# Altium project Vexter.PrjPcb
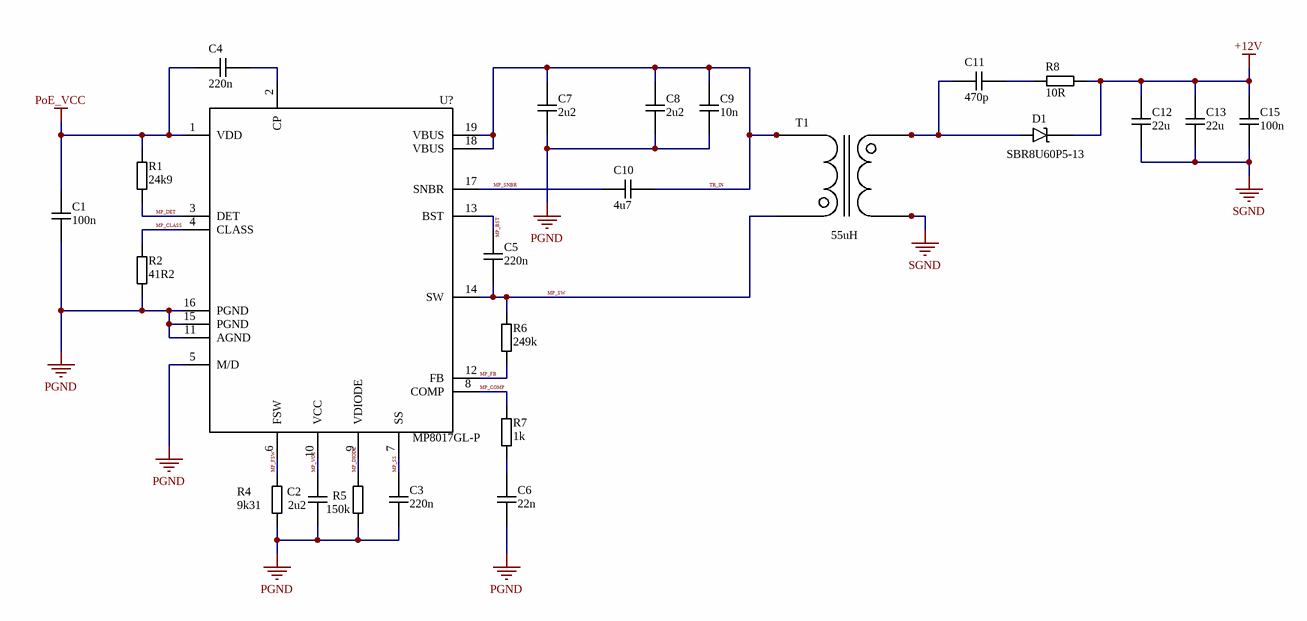
[diagram p0: First page.SchDoc]
1 sheet, 24 parts. Net scope: global (net labels, ports and power ports of the same name join across sheets).
Board file: Vexter_PCB.PcbDoc

## Sheet First page.SchDoc
size A3; SheetNumber: 1; SheetTotal: 1; PageSetup: Record=PageOptions|CenterHorizontal=True|CenterVertical=True|PrintScale=1.00|XCorrection=1.00|YCorrection=1.00|PrintKind=0|BorderSize=5000000|LeftOffset=0|BottomOffset=0|Orientation=2|PaperLength=1000|PaperWidth=1000|Scale=100|PaperSource=7|PrintQuality=-4|MediaType=1|DitherType=10|PaperKind=A3 297 x 420 mm|PrintScaleMode=1

### Parts
C1  100n  [CAP_0603]
C2  2u2  [CAP_0402]
C3  220n  [CAP_0402]
C4  220n  [CAP_0402]
C5  220n  [CAP_0402]
C6  22n  [CAP_0402]
C7  2u2  [CAP_1210]
C8  2u2  [CAP_1210]
C9  10n  [CAP_0603]
C10  4u7  [CAP_0805]
C11  470p  [CAP_0603]
C12  22u  [CAP_0805]
C13  22u  [CAP_0805]
C15  100n  [CAP_0603]
D1  SBR8U60P5-13  [PowerDI5-3]
R1  24k9  [RES_0402]
R2  41R2  [RES_0402]
R4  9k31  [RES_0402]
R5  150k  [RES_0402]
R6  249k  [RES_0402]
R7  1k  [RES_0402]
R8  10R  [RES_1206]
T1  55uH  [TWPEP090909B300T]
U?  MP8017GL-P  [QFN-19 (3mmx4mm)]

### Nets
+12V: C12.2 C13.2 C15.2 D1.K R8.2
PGND: C1.1 C2.1 C3.1 C6.1 C7.1 C8.1 C9.1 R2.1 R4.1 R5.1 U?.5(M/D) U?.11(AGND) U?.15(PGND) U?.16(PGND)
PoE_VCC: C1.2 C4.2 R1.2 U?.1(VDD)
SGND: C12.1 C13.1 C15.1 T1.5 T1.6
MP_BST: C5.2 U?.13(BST)
MP_CLASS: R2.2 U?.4(CLASS)
MP_COMP: R7.2 U?.8(COMP)
MP_DET: R1.1 U?.3(DET)
MP_DIODE: R5.2 U?.9(VDIODE)
MP_FB: R6.1 U?.12(FB)
MP_FSW: R4.2 U?.6(FSW)
MP_SNBR: C10.1 U?.17(SNBR)
MP_SS: C3.2 U?.7(SS)
MP_SW: C5.1 R6.2 T1.3 U?.14(SW)
MP_VCC: C2.2 U?.10(VCC)
TR_IN: C7.2 C8.2 C9.2 C10.2 T1.1 T1.2 U?.18(VBUS) U?.19(VBUS)
NetC4_1: C4.1 U?.2(CP)
NetC6_2: C6.2 R7.1
NetC11_1: C11.1 D1.A T1.7 T1.8
NetC11_2: C11.2 R8.1

### Notes on the sheet
- Board name
- TITLE
- DATE
- REVISION
- DRAWN BY
- PAGE

### Library data of the parts
C1 = CAP_100n_0603_100V_10%_X7R: Capacitor SMD 100n 0603 50V 10% X7R; Manufacturer: Samsung Electro-Mechanics; Part Number: CL10B104KC8NNNC; Generic?: Yes; Obsolete?: No; Distributor Link: https://cz.mouser.com/ProductDetail/Samsung-Electro-Mechanics/CL10B104KC8NNNC?qs=sGAEpiMZZMvsSlwiRhF8qrStdQmkkjBl%2FQhwBGJ%2FxFbl1yCQ6UBl3A%3D%3D; Parameters: 100n_0603_100V_10%_X7R; Box: *; Datasheet: *; Alternative Part Number: *
C2 = CAP_2u2_0402_35V_10%_X5R: Capacitor SMD 2u2 0402 35V 10% X5R; Manufacturer: Murata; Part Number: GRM155R6YA225KE11D; Generic?: Yes; Obsolete?: No; Distributor Link: https://cz.mouser.com/ProductDetail/Murata-Electronics/GRM155R6YA225KE11D?qs=sGAEpiMZZMvsSlwiRhF8qtbaqYG%252B%252Bbbwp%252BrKmbG5LFQ9nM4QIaoJFg%3D%3D; Parameters: 2u2_0402_35V_10%_X5R; Box: *; Datasheet: *; Alternative Part Number: *
C3-C5 = CAP_220n_0402_25V_10%_X5R: Capacitor SMD 220n 0402 25V 10% X5R; Manufacturer: Murata; Part Number: GRT155R61E224KE01D; Generic?: Yes; Obsolete?: No; Distributor Link: https://cz.mouser.com/ProductDetail/Murata-Electronics/GRT155R61E224KE01D?qs=drgMNd%252BkGPMmDaNrMlXt5Q%3D%3D; Parameters: 220n_0402_25V_10%_X5R; Box: *; Datasheet: *; Alternative Part Number: *
C6 = CAP_22n_0402_25V_10%_X7R: Capacitor SMD 22n 0402 25V 10% X7R; Manufacturer: TDK; Part Number: C1005X7R1E223K050BB; Generic?: Yes; Obsolete?: No; Distributor Link: https://cz.mouser.com/ProductDetail/TDK/C1005X7R1E223K050BB?qs=sGAEpiMZZMvsSlwiRhF8qsDt8B2LujiHv9ZMBJ9wABM%3D; Parameters: 22n_0402_25V_10%_X7R; Box: *; Datasheet: *; Alternative Part Number: *
C7 C8 = CAP_2u2_1210_100V_10%_X7R: Capacitor SMD 2u2 1210 100V 10% X7R; Manufacturer: Samsung Electro-Mechanics; Part Number: CL32B225KCJSNNE; Generic?: Yes; Obsolete?: No; Distributor Link: https://cz.mouser.com/ProductDetail/Samsung-Electro-Mechanics/CL32B225KCJSNNE?qs=X6jEic%2FHinBTqQESZCUGKg%3D%3D; Parameters: 2u2_1210_100V_10%_X7R; Box: *; Datasheet: *; Alternative Part Number: *
C9 = CAP_10n_0603_100V_10%_X7R: Capacitor SMD 10n 0603 100V 10% X7R; Manufacturer: Murata; Part Number: GRM188R72A103KA01D; Generic?: Yes; Obsolete?: No; Distributor Link: https://cz.mouser.com/ProductDetail/Murata-Electronics/GRM188R72A103KA01D?qs=krk%2F6UQjCzAtl9phuocbug%3D%3D; Parameters: 10n_0603_100V_10%_X7R; Box: *; Datasheet: *; Alternative Part Number: *
C10 = CAP_4u7_0805_50V_10%_X7R: Capacitor SMD 4u7 0805 50V 10% X7R; Manufacturer: TDK; Part Number: CGA4J1X7R1H475K125AC; Generic?: Yes; Obsolete?: No; Distributor Link: https://cz.mouser.com/ProductDetail/TDK/CGA4J1X7R1H475K125AC?qs=PqoDHHvF64%252BmskN2S82T2g%3D%3D; Parameters: 4u7_0805_50V_10%_X7R; Box: *; Datasheet: *; Alternative Part Number: *
C11 = CAP_470p_0603_100V_10%_X7R: Capacitor SMD 470p 0603 100V 10% X7R; Manufacturer: Samsung Electro-Mechanics; Part Number: CL10B471KC85PNC; Generic?: Yes; Obsolete?: No; Distributor Link: https://cz.mouser.com/ProductDetail/Samsung-Electro-Mechanics/CL10B471KC85PNC?qs=sGAEpiMZZMvsSlwiRhF8qtsGU%2FCnaNeQLkPpNmVwyB%2FzM%252BHMhfj7Ng%3D%3D; Parameters: 470p_0603_100V_10%_X7R; Box: *; Datasheet: *; Alternative Part Number: *
C12 C13 = CAP_22u_0805_25V_20%_X5R: Capacitor SMD 22u 0805 25V 20% X5R; Manufacturer: Samsung Electro-Mechanics; Part Number: CL21A226MAYNNNE; Generic?: Yes; Obsolete?: No; Distributor Link: https://cz.mouser.com/ProductDetail/Samsung-Electro-Mechanics/CL21A226MAYNNNE?qs=sGAEpiMZZMvsSlwiRhF8qtsGU%2FCnaNeQwDZ09%252BwQGHm28IfOP7W13g%3D%3D; Parameters: 22u_0805_25V_20%_X5R; Box: *; Datasheet: *; Alternative Part Number: *
C15 = CAP_100n_0603_50V_10%_X7R: Capacitor SMD 100n 0603 50V 10% X7R; Manufacturer: Samsung Electro-Mechanics; Part Number: CL10B104KB8NNND; Generic?: Yes; Obsolete?: No; Distributor Link: https://cz.mouser.com/ProductDetail/Samsung-Electro-Mechanics/CL10B104KB8NNND?qs=sGAEpiMZZMvsSlwiRhF8qlxW52pIu5FNK3tKzcUaj3w%3D; Parameters: 100n_0603_50V_10%_X7R; Box: *; Datasheet: *; Alternative Part Number: *
D1 = D_SCHOTTKY_60V_8A_Vf_530mV_PowerDI5-3: Schottky Rectifier, Super Barrier, 60 V, 8 A, Single, PowerDI 5, 3 Pins, 530 mV; Manufacturer: Diodes Incorporated; Generic?: No; Part Number: SBR8U60P5-13; Distributor Link: https://cz.mouser.com/ProductDetail/Diodes-Incorporated/SBR8U60P5-13?qs=nSryOFbzj8LdQMI0wTayiw%3D%3D; Parameters: *; Box: *; Datasheet: https://cz.mouser.com/datasheet/2/115/DIODS18049_1-2541727.pdf; Obsolete?: No; Alternative Part Number: *
R1 = RES_24k9_0402_1%: Resistor 24k9 0402 1%; Manufacturer: Bourns; Part Number: CR0402-FX-2492GLF; Generic?: Yes; Obsolete?: No; Distributor Link: https://cz.mouser.com/ProductDetail/Bourns/CR0402-FX-2492GLF?qs=sGAEpiMZZMvdGkrng054t%252BRNGJdg958Rh%252BomGKLrvyo%3D; Parameters: 24k9_0402_1%; Box: *; Datasheet: *; Alternative Part Number: *
R2 = RES_41R2_0402_1%: Resistor SMD 41R2 0402 1%; Manufacturer: Panasonic; Part Number: ERJ-2RKF41R2X; Generic?: Yes; Obsolete?: No; Distributor Link: https://cz.mouser.com/ProductDetail/Panasonic/ERJ-2RKF41R2X?qs=sGAEpiMZZMtlubZbdhIBIH%2FX%2FXYrlp18YchEzQnu88Q%3D; Parameters: 41R2_0402_1%; Box: *; Datasheet: *; Alternative Part Number: *
R4 = RES_9k31_0402_1%: Resistor SMD 9k31 0402 1%; Manufacturer: Bourns; Part Number: CR0402-FX-9311GLF; Generic?: Yes; Obsolete?: No; Distributor Link: https://cz.mouser.com/ProductDetail/Bourns/CR0402-FX-9311GLF?qs=sGAEpiMZZMtlubZbdhIBIA2l6dSgzpPWGjfmsvBq%252BNI%3D; Parameters: 9k31_0402_1%; Box: *; Datasheet: *; Alternative Part Number: *
R5 = RES_150k_0402_1%: Resistor SMD 150k 0402 1%; Manufacturer: Walsin; Part Number: WR04X1503FTL; Generic?: Yes; Obsolete?: No; Distributor Link: https://cz.mouser.com/ProductDetail/Walsin/WR04X1503FTL?qs=sGAEpiMZZMtlubZbdhIBIO6gLQ25xNI8CUhgfgRPVZc%3D; Parameters: 150k_0402_1%; Box: *; Datasheet: *; Alternative Part Number: *
R6 = RES_249k_0402_1%: Resistor SMD 249k 0402 1%; Manufacturer: YAGEO; Part Number: RC0402FR-07249KL; Generic?: Yes; Obsolete?: No; Distributor Link: https://cz.mouser.com/ProductDetail/YAGEO/RC0402FR-07249KL?qs=sGAEpiMZZMvdGkrng054t9CkWbSRI0EFS47avGl7FQg%3D; Parameters: 249k_0402_1%; Box: *; Datasheet: *; Alternative Part Number: *
R7 = RES_1k_0402_0.5%: Resistor SMD 1k 0402 0.5%; Manufacturer: Bourns; Part Number: CRT0402-DY-1001GLF; Generic?: Yes; Obsolete?: No; Distributor Link: https://cz.mouser.com/ProductDetail/Bourns/CRT0402-DY-1001GLF?qs=9qK3lZr%252Bi0KXQwdtUA3%2FBw%3D%3D; Parameters: 1k_0402_0.5%; Box: *; Datasheet: *; Alternative Part Number: *
R8 = RES_10R_1206_1%: Resistor SMD 10R 1206 1%; Manufacturer: YAGEO; Part Number: RC1206FR-0710RL; Generic?: Yes; Obsolete?: No; Distributor Link: https://cz.mouser.com/ProductDetail/YAGEO/RC1206FR-0710RL?qs=%2F8M1ehdqYDBdV11LXpIrWA%3D%3D; Parameters: 10R_1206_1%; Box: *; Datasheet: *; Alternative Part Number: *
T1 = TRN_FLYBACK_57V_12V_1A_EP7: Manufacturer: *; Part Number: *; Distributor Link: *; Parameters: *; Box: *; Datasheet: *; Generic?: *; Obsolete?: *; Alternative Part Number: *
U? = PM_POE_57V_12W_FLYBACK_QFN19: IEEE 802.3af-Compliant PoE PD Solution with Primary- or Secondary-Side Regulation Active-Clamp Flyback Converter; Manufacturer: Monolithic Power Systems (MPS); Generic?: No; Part Number: MP8017GL-P; Distributor Link: https://www.monolithicpower.com/en/mp8017.html; Parameters: *; Box: *; Datasheet: https://www.monolithicpower.com/en/documentview/productdocument/index/version/2/document_type/Datasheet/lang/en/sku/MP8017GL/document_id/9827/; Obsolete?: No; Alternative Part Number: *